# EAGLE design ATMEGA2560 Board (EAGLE 9.6.2)
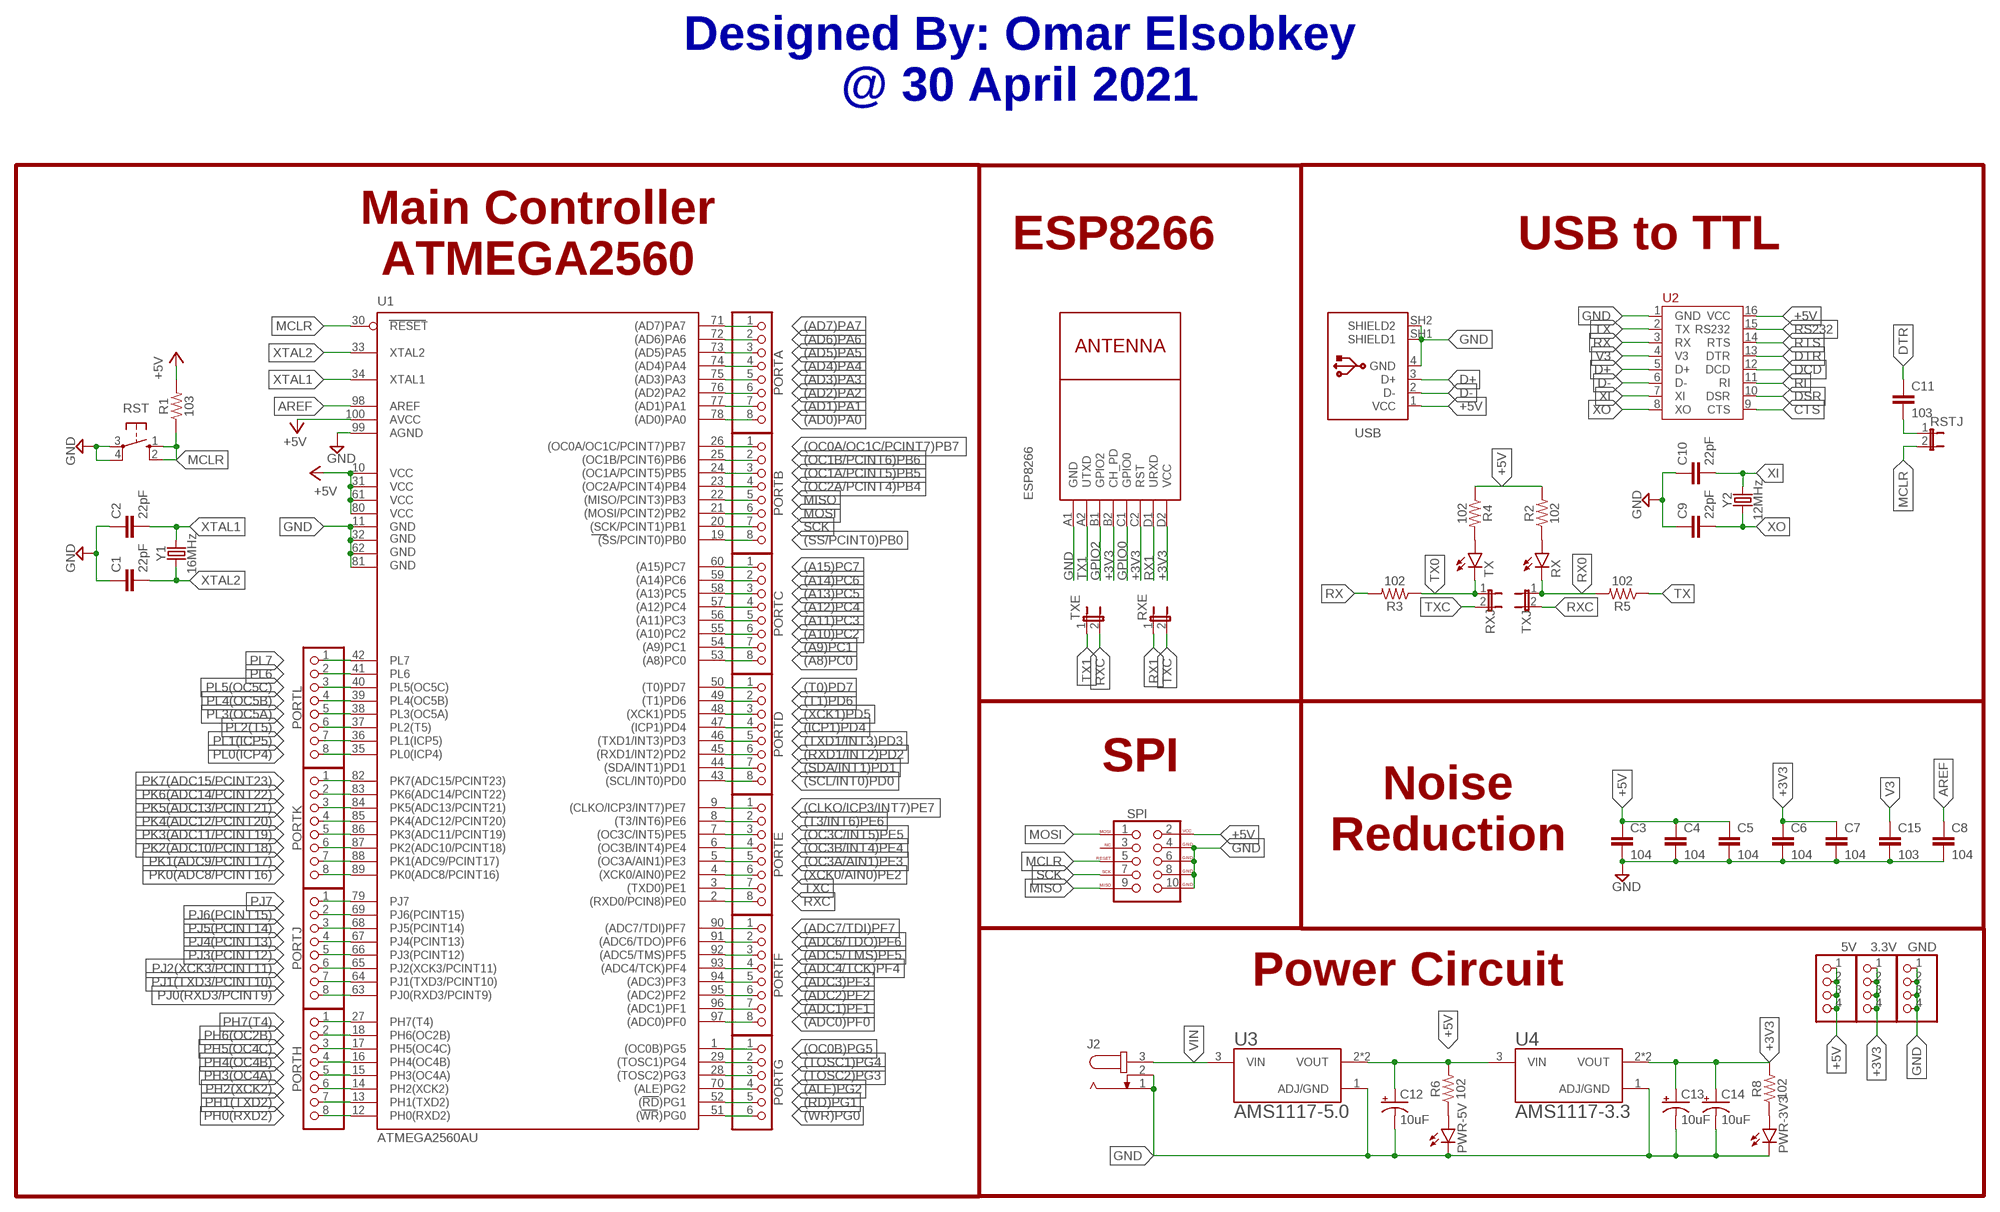
[diagram p0: schematic, sheet 1]

## Parts
3.3V  PINHD-1X4  [1X04]
5V  PINHD-1X4  [1X04]
C1  22pF  22PF-PTH-2.54MM-200V-5%  [CAP-PTH-2.54]
C2  22pF  22PF-PTH-2.54MM-200V-5%  [CAP-PTH-2.54]
C3  104  22PF-PTH-2.54MM-200V-5%  [CAP-PTH-2.54]
C4  104  22PF-PTH-2.54MM-200V-5%  [CAP-PTH-2.54]
C5  104  22PF-PTH-2.54MM-200V-5%  [CAP-PTH-2.54]
C6  104  22PF-PTH-2.54MM-200V-5%  [CAP-PTH-2.54]
C7  104  22PF-PTH-2.54MM-200V-5%  [CAP-PTH-2.54]
C8  104  22PF-PTH-2.54MM-200V-5%  [CAP-PTH-2.54]
C9  22pF  22PF-PTH-2.54MM-200V-5%  [CAP-PTH-2.54]
C10  22pF  22PF-PTH-2.54MM-200V-5%  [CAP-PTH-2.54]
C11  103  22PF-PTH-2.54MM-200V-5%  [CAP-PTH-2.54]
C12  10uF  10UF-POLAR-RADIAL-2.5MM-KIT-25V-20%  [CPOL-RADIAL-2.5MM-5MM-KIT]
C13  10uF  10UF-POLAR-RADIAL-2.5MM-KIT-25V-20%  [CPOL-RADIAL-2.5MM-5MM-KIT]
C14  10uF  10UF-POLAR-RADIAL-2.5MM-KIT-25V-20%  [CPOL-RADIAL-2.5MM-5MM-KIT]
C15  103  22PF-PTH-2.54MM-200V-5%  [CAP-PTH-2.54]
ESP8266  WIRELESS-WIFI-ESP-01  [WIRELESS-WIFI-ESP-01]
GND  PINHD-1X4  [1X04]
J2  JACK-PLUG0  [SPC4077]
PORTA  PINHD-1X8  [1X08]
PORTB  PINHD-1X8  [1X08]
PORTC  PINHD-1X8  [1X08]
PORTD  PINHD-1X8  [1X08]
PORTE  PINHD-1X8  [1X08]
PORTF  PINHD-1X8  [1X08]
PORTG  PINHD-1X6  [1X06]
PORTH  PINHD-1X8  [1X08]
PORTJ  PINHD-1X8  [1X08]
PORTK  PINHD-1X8  [1X08]
PORTL  PINHD-1X8  [1X08]
PWR-3V3  LEDCHIP-LED0805  [CHIP-LED0805]
PWR-5V  LEDCHIP-LED0805  [CHIP-LED0805]
R1  103  RESISTOR1206  [1206]
R2  102  RESISTOR1206  [1206]
R3  102  RESISTOR1206  [1206]
R4  102  RESISTOR1206  [1206]
R5  102  RESISTOR1206  [1206]
R6  102  RESISTOR1206  [1206]
R8  102  RESISTOR1206  [1206]
RST  10-XX  [B3F-10XX]
RSTJ  JP1E  [JP1]
RX  LEDCHIP-LED0805  [CHIP-LED0805]
RXE  JP1E  [JP1]
RXJ  JP1E  [JP1]
SPI  AVR_SPI_PROG_5X2LOCK  [2X5-SHROUDED_LOCK]
TX  LEDCHIP-LED0805  [CHIP-LED0805]
TXE  JP1E  [JP1]
TXJ  JP1E  [JP1]
U1  ATMEGA2560AU  [TQFP100]
U2  CH340G  [SOP-16]
U3  AMS1117-5.0  [AMS1117-5.0]
U4  AMS1117-3.3  AMS1117-5.0  [AMS1117-5.0]
USB  61729-1011  [61729-1011BLF]
Y1  16MHz  CRYSTALPTH-HC49UV  [HC49U]
Y2  12MHz  CRYSTALPTH-HC49UV  [HC49U]

## Nets
(A8)PC0: PORTC.8 U1.53((A8)PC0)
(A9)PC1: PORTC.7 U1.54((A9)PC1)
(A10)PC2: PORTC.6 U1.55((A10)PC2)
(A11)PC3: PORTC.5 U1.56((A11)PC3)
(A12)PC4: PORTC.4 U1.57((A12)PC4)
(A13)PC5: PORTC.3 U1.58((A13)PC5)
(A14)PC6: PORTC.2 U1.59((A14)PC6)
(A15)PC7: PORTC.1 U1.60((A15)PC7)
(AD0)PA0: PORTA.8 U1.78((AD0)PA0)
(AD1)PA1: PORTA.7 U1.77((AD1)PA1)
(AD2)PA2: PORTA.6 U1.76((AD2)PA2)
(AD3)PA3: PORTA.5 U1.75((AD3)PA3)
(AD4)PA4: PORTA.4 U1.74((AD4)PA4)
(AD5)PA5: PORTA.3 U1.73((AD5)PA5)
(AD6)PA6: PORTA.2 U1.72((AD6)PA6)
(AD7)PA7: PORTA.1 U1.71((AD7)PA7)
(ADC0)PF0: PORTF.8 U1.97((ADC0)PF0)
(ADC1)PF1: PORTF.7 U1.96((ADC1)PF1)
(ADC2)PF2: PORTF.6 U1.95((ADC2)PF2)
(ADC3)PF3: PORTF.5 U1.94((ADC3)PF3)
(ADC4/TCK)PF4: PORTF.4 U1.93((ADC4/TCK)PF4)
(ADC5/TMS)PF5: PORTF.3 U1.92((ADC5/TMS)PF5)
(ADC6/TDO)PF6: PORTF.2 U1.91((ADC6/TDO)PF6)
(ADC7/TDI)PF7: PORTF.1 U1.90((ADC7/TDI)PF7)
(ALE)PG2: PORTG.4 U1.70((ALE)PG2)
(CLKO/ICP3/INT7)PE7: PORTE.1 U1.9((CLKO/ICP3/INT7)PE7)
(ICP1)PD4: PORTD.4 U1.47((ICP1)PD4)
(OC0A/OC1C/PCINT7)PB7: PORTB.1 U1.26((OC0A/OC1C/PCINT7)PB7)
(OC0B)PG5: PORTG.1 U1.1((OC0B)PG5)
(OC1A/PCINT5)PB5: PORTB.3 U1.24((OC1A/PCINT5)PB5)
(OC1B/PCINT6)PB6: PORTB.2 U1.25((OC1B/PCINT6)PB6)
(OC2A/PCINT4)PB4: PORTB.4 U1.23((OC2A/PCINT4)PB4)
(OC3A/AIN1)PE3: PORTE.5 U1.5((OC3A/AIN1)PE3)
(OC3B/INT4)PE4: PORTE.4 U1.6((OC3B/INT4)PE4)
(OC3C/INT5)PE5: PORTE.3 U1.7((OC3C/INT5)PE5)
(RD)PG1: PORTG.5 U1.52((RD)PG1)
(RXD1/INT2)PD2: PORTD.6 U1.45((RXD1/INT2)PD2)
(SCL/INT0)PD0: PORTD.8 U1.43((SCL/INT0)PD0)
(SDA/INT1)PD1: PORTD.7 U1.44((SDA/INT1)PD1)
(SS/PCINT0)PB0: PORTB.8 U1.19((SS/PCINT0)PB0)
(T0)PD7: PORTD.1 U1.50((T0)PD7)
(T1)PD6: PORTD.2 U1.49((T1)PD6)
(T3/INT6)PE6: PORTE.2 U1.8((T3/INT6)PE6)
(TOSC1)PG4: PORTG.2 U1.29((TOSC1)PG4)
(TOSC2)PG3: PORTG.3 U1.28((TOSC2)PG3)
(TXD1/INT3)PD3: PORTD.5 U1.46((TXD1/INT3)PD3)
(WR)PG0: PORTG.6 U1.51((WR)PG0)
(XCK0/AIN0)PE2: PORTE.6 U1.4((XCK0/AIN0)PE2)
(XCK1)PD5: PORTD.3 U1.48((XCK1)PD5)
+3V3: 3.3V.1 3.3V.2 3.3V.3 3.3V.4 C6.1 C7.1 C13.1(+) C14.1(+) ESP8266.B2(CH_PD) ESP8266.C2(RST) ESP8266.D2(VCC) R8.2 U4.2(VOUT) U4.4(VOUT)
+5V: 5V.1 5V.2 5V.3 5V.4 C3.1 C4.1 C5.1 C12.1(+) R1.2 R2.2 R4.1 R6.2 SPI.2(VCC) U1.10(VCC) U1.31(VCC1) U1.61(VCC2) U1.80(VCC3) U1.100(AVCC) U2.16(VCC) U3.2(VOUT) U3.4(VOUT) U4.3(VIN) USB.1(VCC)
AREF: C8.1 U1.98(AREF)
CTS: U2.9(CTS)
D+: U2.5(D+) USB.3(D+)
D-: U2.6(D-) USB.2(D-)
DCD: U2.12(DCD)
DSR: U2.10(DSR)
DTR: C11.1 U2.13(DTR)
GND: C1.1 C2.1 C3.2 C4.2 C5.2 C6.2 C7.2 C8.2 C9.1 C10.1 C12.2(-) C13.2(-) C14.2(-) C15.2 ESP8266.A1(GND) GND.1 GND.2 GND.3 GND.4 J2.1 J2.2 PWR-3V3.C PWR-5V.C RST.3(P) RST.4(P1) SPI.4(GND) SPI.6(GND) SPI.8(GND) SPI.10(GND) U1.11(GND) U1.32(GND1) U1.62(GND2) U1.81(GND3) U1.99(AGND) U2.1(GND) U3.1(ADJ/GND) U4.1(ADJ/GND) USB.4(GND) USB.SH1(SHIELD1) USB.SH2(SHIELD2)
GPIO0: ESP8266.C1(GPIO0)
GPIO2: ESP8266.B1(GPIO2)
MCLR: R1.1 RST.1(S) RST.2(S1) RSTJ.2 SPI.5(RESET) U1.30(RESET)
MISO: PORTB.5 SPI.9(MISO) U1.22((MISO/PCINT3)PB3)
MOSI: PORTB.6 SPI.1(MOSI) U1.21((MOSI/PCINT2)PB2)
N$1: R2.1 RX.A
N$2: R4.2 TX.A
N$3: PWR-5V.A R6.1
N$6: PWR-3V3.A R8.1
N$100: C11.2 RSTJ.1
PH0(RXD2): PORTH.8 U1.12(PH0(RXD2))
PH1(TXD2): PORTH.7 U1.13(PH1(TXD2))
PH2(XCK2): PORTH.6 U1.14(PH2(XCK2))
PH3(OC4A): PORTH.5 U1.15(PH3(OC4A))
PH4(OC4B): PORTH.4 U1.16(PH4(OC4B))
PH5(OC4C): PORTH.3 U1.17(PH5(OC4C))
PH6(OC2B): PORTH.2 U1.18(PH6(OC2B))
PH7(T4): PORTH.1 U1.27(PH7(T4))
PJ0(RXD3/PCINT9): PORTJ.8 U1.63(PJ0(RXD3/PCINT9))
PJ1(TXD3/PCINT10): PORTJ.7 U1.64(PJ1(TXD3/PCINT10))
PJ2(XCK3/PCINT11): PORTJ.6 U1.65(PJ2(XCK3/PCINT11))
PJ3(PCINT12): PORTJ.5 U1.66(PJ3(PCINT12))
PJ4(PCINT13): PORTJ.4 U1.67(PJ4(PCINT13))
PJ5(PCINT14): PORTJ.3 U1.68(PJ5(PCINT14))
PJ6(PCINT15): PORTJ.2 U1.69(PJ6(PCINT15))
PJ7: PORTJ.1 U1.79(PJ7)
PK0(ADC8/PCINT16): PORTK.8 U1.89(PK0(ADC8/PCINT16))
PK1(ADC9/PCINT17): PORTK.7 U1.88(PK1(ADC9/PCINT17))
PK2(ADC10/PCINT18): PORTK.6 U1.87(PK2(ADC10/PCINT18))
PK3(ADC11/PCINT19): PORTK.5 U1.86(PK3(ADC11/PCINT19))
PK4(ADC12/PCINT20): PORTK.4 U1.85(PK4(ADC12/PCINT20))
PK5(ADC13/PCINT21): PORTK.3 U1.84(PK5(ADC13/PCINT21))
PK6(ADC14/PCINT22): PORTK.2 U1.83(PK6(ADC14/PCINT22))
PK7(ADC15/PCINT23): PORTK.1 U1.82(PK7(ADC15/PCINT23))
PL0(ICP4): PORTL.8 U1.35(PL0(ICP4))
PL1(ICP5): PORTL.7 U1.36(PL1(ICP5))
PL2(T5): PORTL.6 U1.37(PL2(T5))
PL3(OC5A): PORTL.5 U1.38(PL3(OC5A))
PL4(OC5B): PORTL.4 U1.39(PL4(OC5B))
PL5(OC5C): PORTL.3 U1.40(PL5(OC5C))
PL6: PORTL.2 U1.41(PL6)
PL7: PORTL.1 U1.42(PL7)
RI: U2.11(RI)
RS232: U2.15(RS232)
RTS: U2.14(RTS)
RX: R3.2 U2.3(RX)
RX0: R5.2 RX.C TXJ.1
RX1: ESP8266.D1(URXD) RXE.1
RXC: PORTE.8 TXE.2 TXJ.2 U1.2((RXD0/PCIN8)PE0)
SCK: PORTB.7 SPI.7(SCK) U1.20((SCK/PCINT1)PB1)
TX: R5.1 U2.2(TX)
TX0: R3.1 RXJ.1 TX.C
TX1: ESP8266.A2(UTXD) TXE.1
TXC: PORTE.7 RXE.2 RXJ.2 U1.3((TXD0)PE1)
V3: C15.1 U2.4(V3)
VIN: J2.3 U3.3(VIN)
XI: C10.2 U2.7(XI) Y2.2
XO: C9.2 U2.8(XO) Y2.1
XTAL1: C2.2 U1.34(XTAL1) Y1.2
XTAL2: C1.2 U1.33(XTAL2) Y1.1
Unconnected: SPI.3(NC)

## Notes on the sheet
- Designed By: Omar Elsobkey
  @ 30 April 2021
- Main Controller
  ATMEGA2560
- ESP8266 | USB to TTL
- SPI
- Noise
  Reduction
- Power Circuit

## Library data of the parts
3.3V 5V GND = pinhead:PINHD-1X4: PIN HEADER
C1 C2 C9 C10 = SparkFun-Capacitors:22PF: 22pF ceramic capacitors A capacitor is a passive two-terminal electrical component used to store electrical energy temporarily in an electric field.; PROD_ID: CAP-09128
C3-C8 C11 C15 = SparkFun-Capacitors:22PF: 22pF ceramic capacitors A capacitor is a passive two-terminal electrical component used to store electrical energy temporarily in an electric field.; PROD_ID: CAP-09128; VALUE: 22pF
C12-C14 = SparkFun-Capacitors:10UF-POLAR: 10.0µF polarized capacitors A capacitor is a passive two-terminal electrical component used to store electrical energy temporarily in an electric field.; PROD_ID: CAP-08440
ESP8266 = Modules:WIRELESS-WIFI-ESP-01: Wireless Wi-Fi ESP-01 Module based on ESP8266 chip Click here to find device on ebay.com <http://www.ebay.com/sch/esp8266+esp+01+transceiver>
J2 = con-jack:JACK-PLUG: DC POWER JACK Power Jack, DC, Right Angle, Through Hole, Rated 5A at 16VDC, PC Terminals Distributor: Farnell (www.Farnell.de) Drawing: 84N1161.pdf / 84N1162.pdf Manufacturer: SPC Technology (www.spctechnology.com) Type: SPC4077 / SPC 4078; OC_FARNELL: unknown; OC_NEWARK: unknown
PORTA PORTB PORTC PORTD PORTE PORTF PORTH PORTJ PORTK PORTL = pinhead:PINHD-1X8: PIN HEADER
PORTG = pinhead:PINHD-1X6: PIN HEADER
PWR-3V3 PWR-5V RX TX = led:LED: LED OSRAM: - CHIPLED LG R971, LG N971, LY N971, LG Q971, LY Q971, LO R971, LY R971 LH N974, LH R974 LS Q976, LO Q976, LY Q976 LO Q996 - Hyper CHIPLED LW Q18S LB Q993, LB Q99A, LB R99A - SideLED LS A670, LO A670, LY A670, LG A670, LP A670 LB A673, LV A673, LT A673, LW A673 LH A674 LY A675 LS A676, LA A676, LO A676, LY A676, LW A676 LS A679, LY A679, LG A679 - Hyper Micro SIDELED® LS Y876, LA Y876, LO Y876, LY Y876 LT Y87S - SmartLED LW L88C, LW L88S LB L89C, LB L89S, LG L890 LS L89K, LO L89K, LY L89K LS L896, LA L896, LO L896, LY L896 - TOPLED LS T670, LO T670, LY T670, LG T670, LP T670 LSG T670, LSP T670, LSY T670, LOP T670, LYG T670 LG T671, LOG T671, LSG T671 LB T673, LV T673, LT T673, LW T673 LH T674 LS T676, LA T676, LO T676, LY T676, LB T676, LH T676, LSB T676, LW T676 LB T67C, LV T67C, LT T67C, LS T67K, LO T67K, LY T67K, LW E67C LS E67B, LA E67B, LO E67B, LY E67B, LB E67C, LV E67C, LT E67C LW T67C LS T679, LY T679, LG T679 LS T770, LO T770, LY T770, LG T770, LP T770 LB T773, LV T773, LT T773, LW T773 LH T774 LS E675, LA E675, LY E675, LS T675 LS T776, LA T776, LO T776, LY T776, LB T776 LHGB T686 LT T68C, LB T68C - Hyper Mini TOPLED® LB M676 - Mini TOPLED Santana® LG M470 LS M47K, LO M47K, LY M47K Source: http://www.osram.convergy.de LUXEON: - LUMILED® LXK2-PW12-R00, LXK2-PW12-S00, LXK2-PW14-U00, LXK2-PW14-V00 LXK2-PM12-R00, LXK2-PM12-S00, LXK2-PM14-U00 LXK2-PE12-Q00, LXK2-PE12-R00, LXK2-PE12-S00, LXK2-PE14-T00, LXK2-PE14-U00 LXK2-PB12-K00, LXK2-PB12-L00, LXK2-PB12-M00, LXK2-PB14-N00, LXK2-PB14-P00, LXK2-PB14-Q00 LXK2-PR12-L00, LXK2-PR12-M00, LXK2-PR14-Q00, LXK2-PR14-R00 LXK2-PD12-Q00, LXK2-PD12-R00, LXK2-PD12-S00 LXK2-PH12-R00, LXK2-PH12-S00 LXK2-PL12-P00, LXK2-PL12-Q00, LXK2-PL12-R00 Source: www.luxeon.com KINGBRIGHT: KA-3528ASYC Source: www.kingbright.com
R1-R6 R8 = SparkFun-Resistors:RESISTOR: Generic Resistor Package
RST = switch-omron:10-XX: OMRON SWITCH; MPN: B3F-1000; OC_FARNELL: 176432; OC_NEWARK: 36M3542
RSTJ RXE RXJ TXE TXJ = jumper:JP1E: JUMPER
SPI = SparkFun-Connectors:AVR_SPI_PROG_5X2: AVR 10-pin ICSP Header This is the standard AVR In Circuit Serial Programming header. Minimal, but includes pin one indicator. Works with standard Olimex programmers. SparkFun Products: 2x5 AVR ICSP Male Header <https://www.sparkfun.com/products/778> - PTH 2x5 Pin Shrouded Header <https://www.sparkfun.com/products/8506> - PTH2; PROD_ID: CONN-08671; SF_ID: PRT-08506
U1 = SparkFun-IC-Microcontroller:ATMEGA2560: Atmel 100-pin 8-bit uC 64/128/256 Kbytes FLASH 4 Kbytes EEPROM 8 Kbytes SRAM 86 General Purpose I/O pins 12-channels16-bit PWM 4 x Serial USARTs 16-channels 10-bit A/D SparkFun Products None.; PROD_ID: IC-10040
U2 = CH340G:CH340G
U3 U4 = AMS1117-5.0:AMS1117-5.0: Sot223/Pkg 1-Amp 5-Volt Low Drop Out Voltage Regulatator; AVAILABILITY: Unavailable; DESCRIPTION: Sot223/Pkg 1-Amp 5-Volt Low Drop Out Voltage Regulatator; MF: Advanced Monolithic Systems; MP: AMS1117-5.0; PACKAGE: None; PRICE: None
USB = Connector_USB:61729-1011: USB(2.0) Type-B, RCPT, 4POS, THT-R/A Datasheet <https://www.amphenol-icc.com/media/wysiwyg/files/drawing/61729.pdf>; CATEGORY: Connector; CONTACTS: 4; CURRENT_RATING: 1A; DESCRIPTION: CONN RCPT USB2.0 TYPEB 4POS R/A; GENDER: Receptacle; MANUFACTURER: Amphenol ICC (FCI); MOUNT_TYPE: R/A; MPN: 61729-1011BLF; OPERATING_TEMP: -55°C to 85°C; PART_STATUS: Active; ROHS_COMPLIANT: RoHS Compliant; SERIES: 61729; SUB-CATEGORY: USB; TYPE: USB-B
Y1 Y2 = SparkFun-Clocks:CRYSTAL: Crystals (Generic) These are passive quartz crystals, which can be used as a clock source for a microcontroller. Crystal's are two-terminal devices. They require external "load" capacitors to generate an oscillating signal.

## Board
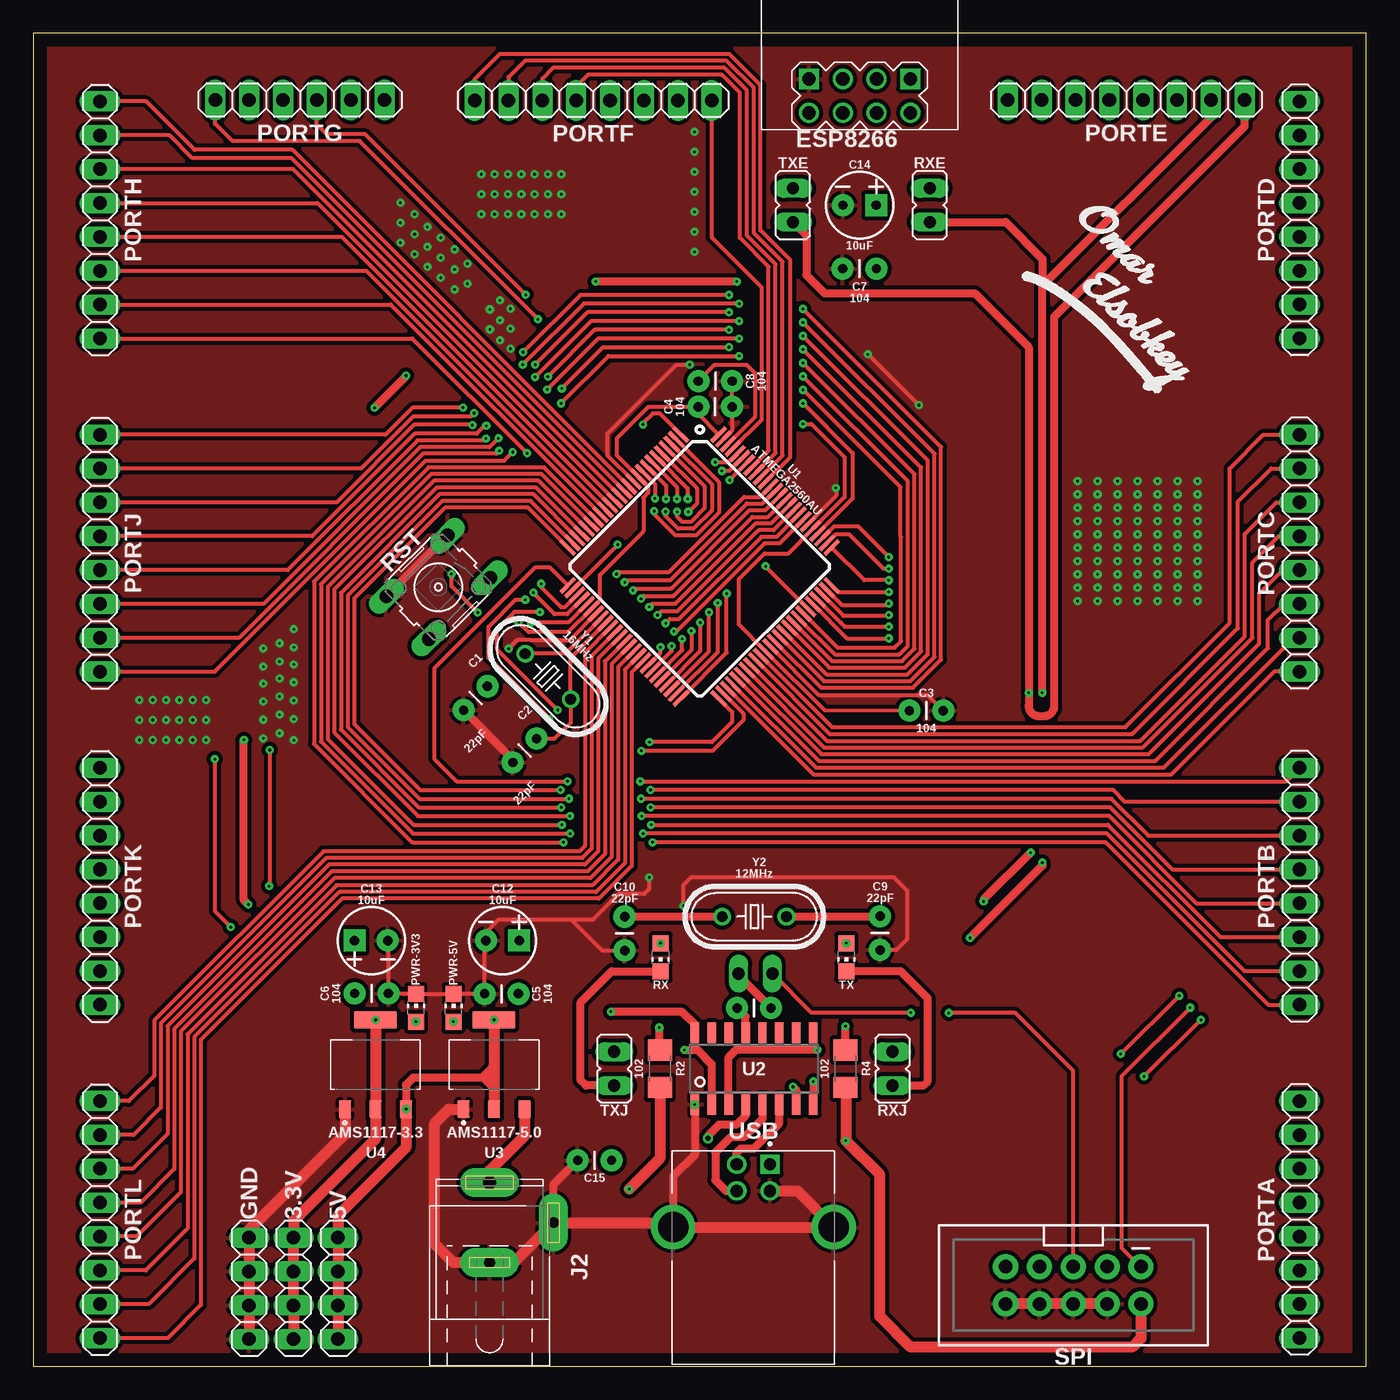
[diagram p1: board, top side]
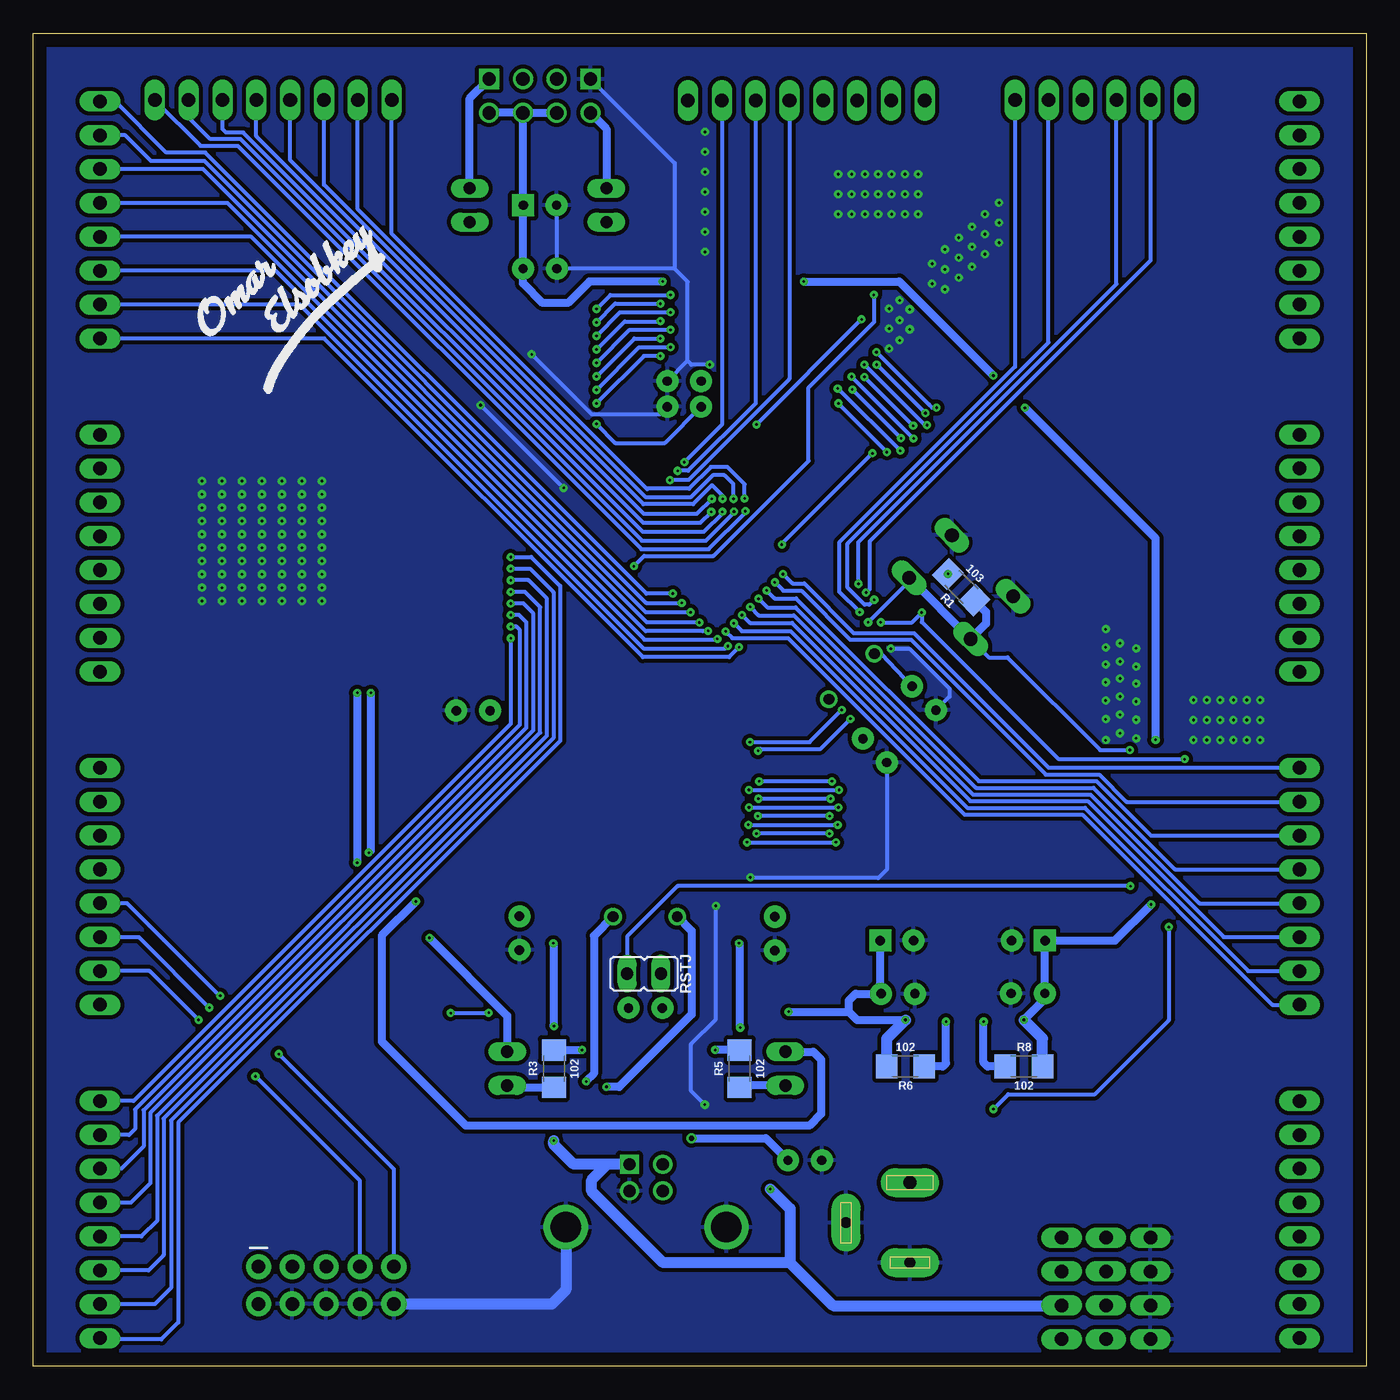
[diagram p2: board, bottom side, seen from below]

Size 100 x 100 mm. Coordinates in mm from the lower left corner, seen from the top.
Outline: 0,0 100,0 100,100 0,100 0,0
Copper layers (1*16): Top 0.035mm / dielectric 1.5mm / Bottom 0.035mm
Design rules "default *": minimum track width 0.3mm, minimum drill 0.2mm, track to track 0.2mm, track to pad 0.2mm, pad to pad 0.2mm, via to via 0.2mm, smd to smd 0.2mm, copper to edge 40mil, drill to drill 6mil, minimum pad ring 10mil, minimum via ring 8mil, stop-mask expansion 4mil, vias tented up to drill 0mil, thermal gap 10mil

### Footprints (pad centres in the part's own frame; a part is rotated, then mirrored left to right if it is on the bottom)
1X04 = drill 1.016 long: 1 -3.81,0; 2 -1.27,0; 3 1.27,0; 4 3.81,0
CAP-PTH-2.54 = drill 0.7 pad 1.651: 1 -1.27,0; 2 1.27,0
CPOL-RADIAL-2.5MM-5MM-KIT = drill 0.7 pad 1.651 square: 1 1.25,0 | drill 0.7 pad 1.651: 2 -1.25,0
WIRELESS-WIFI-ESP-01 = drill 1 square: A1 -8.89,3.81; D1 -8.89,-3.81 | drill 1: A2 -11.43,3.81; B1 -8.89,1.27; B2 -11.43,1.27; C1 -8.89,-1.27; C2 -11.43,-1.27; D2 -11.43,-3.81
SPC4077 = drill 0.8 pad 2.184 long: 1 -3,0; 2 0,-4.8 | drill 1 pad 2.184 long: 3 3,0
1X08 = drill 1.016 long: 1 -8.89,0; 2 -6.35,0; 3 -3.81,0; 4 -1.27,0; 5 1.27,0; 6 3.81,0; 7 6.35,0; 8 8.89,0
1X06 = drill 1.016 long: 1 -6.35,0; 2 -3.81,0; 3 -1.27,0; 4 1.27,0; 5 3.81,0; 6 6.35,0
CHIP-LED0805 = smd 1.2 x 1.2: A 0,-1.05; C 0,1.05
1206 = smd 1.6 x 1.8: 1 -1.4,0; 2 1.4,0
B3F-10XX = drill 1.016 long: 1 -3.251,2.261; 2 3.251,2.261; 3 -3.251,-2.261; 4 3.251,-2.261
JP1 = drill 0.914 long: 1 0,-1.27; 2 0,1.27
2X5-SHROUDED_LOCK = drill 1.016 pad 1.88: 1 -1.397,5.08; 2 1.397,5.08; 3 -1.397,2.54; 4 1.397,2.54; 5 -1.397,0; 6 1.397,0; 7 -1.397,-2.54; 8 1.397,-2.54; 9 -1.397,-5.08; 10 1.397,-5.08
TQFP100 = smd 1.5 x 0.3: 1 -8,6; 2 -8,5.5; 3 -8,5; 4 -8,4.5; 5 -8,4; 6 -8,3.5; 7 -8,3; 8 -8,2.5; 9 -8,2; 10 -8,1.5; 11 -8,1; 12 -8,0.5; 13 -8,0; 14 -8,-0.5; 15 -8,-1; 16 -8,-1.5; 17 -8,-2; 18 -8,-2.5; 19 -8,-3; 20 -8,-3.5; 21 -8,-4; 22 -8,-4.5; 23 -8,-5; 24 -8,-5.5; 25 -8,-6; 51 8,-6; 52 8,-5.5; 53 8,-5; 54 8,-4.5; 55 8,-4; 56 8,-3.5; 57 8,-3; 58 8,-2.5; 59 8,-2; 60 8,-1.5; 61 8,-1; 62 8,-0.5; 63 8,0; 64 8,0.5; 65 8,1; 66 8,1.5; 67 8,2; 68 8,2.5; 69 8,3; 70 8,3.5; 71 8,4; 72 8,4.5; 73 8,5; 74 8,5.5; 75 8,6 | smd 0.3 x 1.5: 26 -6,-8; 27 -5.5,-8; 28 -5,-8; 29 -4.5,-8; 30 -4,-8; 31 -3.5,-8; 32 -3,-8; 33 -2.5,-8; 34 -2,-8; 35 -1.5,-8; 36 -1,-8; 37 -0.5,-8; 38 0,-8; 39 0.5,-8; 40 1,-8; 41 1.5,-8; 42 2,-8; 43 2.5,-8; 44 3,-8; 45 3.5,-8; 46 4,-8; 47 4.5,-8; 48 5,-8; 49 5.5,-8; 50 6,-8; 76 6,8; 77 5.5,8; 78 5,8; 79 4.5,8; 80 4,8; 81 3.5,8; 82 3,8; 83 2.5,8; 84 2,8; 85 1.5,8; 86 1,8; 87 0.5,8; 88 0,8; 89 -0.5,8; 90 -1,8; 91 -1.5,8; 92 -2,8; 93 -2.5,8; 94 -3,8; 95 -3.5,8; 96 -4,8; 97 -4.5,8; 98 -5,8; 99 -5.5,8; 100 -6,8
SOP-16 = smd 0.635 x 1.524: 1 -4.445,-2.695; 2 -3.175,-2.695; 3 -1.905,-2.695; 4 -0.635,-2.695; 5 0.635,-2.695; 6 1.905,-2.695; 7 3.175,-2.695; 8 4.445,-2.695; 9 4.445,2.695; 10 3.175,2.695; 11 1.905,2.695; 12 0.635,2.695; 13 -0.635,2.695; 14 -1.905,2.695; 15 -3.175,2.695; 16 -4.445,2.695
AMS1117-5.0 = smd 0.93 x 1.31: 1 -2.29,-3.345; 2 0,-3.345; 3 2.29,-3.345 | smd 3.24 x 1.31: 4 0,3.345
61729-1011BLF = drill 0.92 square: 1 1.25,4.71 | drill 0.92: 2 -1.25,4.71; 3 -1.25,2.71; 4 1.25,2.71 | drill 2.3: SH1 -6.02,0; SH2 6.02,0
HC49U = drill 0.813: 1 -2.413,0; 2 2.413,0

### Placement (x,y rotation side)
3.3V  19.52,5.83 270 top
5V  22.86,5.83 270 top
C1  33.18,50.11 45 top
C2  36.86,46.19 45 top
C3  67,49.18 0 top
C4  51.16,71.99 0 top
C5  35.13,27.94 180 top
C6  25.37,27.97 0 top
C7  61.99,82.35 180 top
C8  51.16,73.91 0 top
C9  63.53,32.49 90 top
C10  44.36,32.46 90 top
C11  54.07,26.87 0 top
C12  35.2,31.93 0 top
C13  25.35,31.93 180 top
C14  61.99,87.1 0 top
C15  42.11,15.44 180 top
ESP8266  62,105.46 90 top
GND  16.19,5.83 270 top
J2  34.23,10.76 90 top
PORTA  95,11 270 top
PORTB  95,36 270 top
PORTC  95,61 270 top
PORTD  95,86 270 top
PORTE  82,95 0 top
PORTF  42,94.97 0 top
PORTG  20,95 0 top
PORTH  5,86 90 top
PORTJ  5,61 90 top
PORTK  5,36 90 top
PORTL  5,11 90 top
PWR-3V3  28.7,26.9 0 top
PWR-5V  31.52,26.9 0 top
R1  30.38,58.45 135 bottom
R2  47.01,22.32 270 top
R3  60.94,22.32 90 bottom
R4  60.94,22.32 90 top
R5  47.01,22.32 270 bottom
R6  34.57,22.48 180 bottom
R8  25.68,22.48 0 bottom
RST  30.38,58.45 225 top
RSTJ  54.18,29.45 90 bottom
RX  47.06,30.68 180 top
RXE  67.26,87.1 180 top
RXJ  64.45,22.32 0 top
SPI  78.03,6.07 270 top
TX  60.99,30.68 180 top
TXE  57,87.1 180 top
TXJ  43.58,22.32 0 top
U1  50,60 315 top
U2  54.07,22.32 0 top
U3  34.57,22.63 0 top
U4  25.68,22.63 0 top
U$1  [OMAR_ELSOBKEY_X1]  81.53,80.47 315 top
U$2  [OMAR_ELSOBKEY_X1]  81.08,80.37 45 bottom
USB  54.02,10.44 0 top
Y1  38.61,51.75 315 top
Y2  54.1,33.73 180 top

### Tracks (layer width: path | path; a pad name or v marks a point on that pad's centre or on a via)
(A8)PC0
  Top 0.3: U1.53 58.53,44.4 85.39,44.4 93.11,52.11 PORTC.8
(A9)PC1
  Top 0.3: U1.54 58.73,44.91 84.81,44.91 94.55,54.65 PORTC.7
(A10)PC2
  Top 0.3: U1.55 58.93,45.41 84.18,45.41 92.63,53.87 92.63,55.98 93.84,57.19 PORTC.6
(A11)PC3
  Top 0.3: U1.56 59.13,45.92 83.69,45.92 91.97,54.2 91.97,57.97 93.73,59.73 PORTC.5
(A12)PC4
  Top 0.3: U1.57 | PORTC.4 93.44,62.27 91.47,60.31 91.47,54.63 83.26,46.42 59.33,46.42 U1.57
(A13)PC5
  Top 0.3: U1.58 59.54,46.92 83.05,46.92 90.88,54.75 90.88,62.43 93.26,64.81 PORTC.3
(A14)PC6
  Top 0.3: U1.59 59.72,47.45 82.45,47.45 90.38,55.38 90.38,64.85 92.88,67.35 PORTC.2
(A15)PC7
  Top 0.3: U1.60 59.93,47.95 81.94,47.95 89.76,55.77 89.76,67.36 92.29,69.89 PORTC.1
(AD0)PA0  (via drill 0.2 pad 0.3)
  Top 0.3: U1.78 60.09,63.02 61.87,63.02 v64.19,60.71
  Bottom 0.3: 64.19,60.69 v64.19,60.71 64.17,60.72 62.66,60.72 60.48,58.54 60.48,46.92 89.12,18.28 89.12,3.29 90.4,2.01 94.9,2.01 PORTA.8
(AD1)PA1  (via drill 0.2 pad 0.3)
  Top 0.3: U1.77 60.2,62.43 61.2,62.43 63.79,59.84 v64.19,59.84
  Bottom 0.3: 64.19,59.82 v64.19,59.84 62.73,59.84 60.98,58.08 60.98,47.13 89.66,18.44 89.66,5.87 90.88,4.65 PORTA.7
(AD2)PA2  (via drill 0.2 pad 0.3)
  Top 0.3: U1.76 62.34,58.98 64.17,58.98 v64.19,58.96 64.19,58.99
  Bottom 0.3: PORTA.6 91.36,7.19 90.22,8.33 90.22,18.59 61.48,47.33 61.48,57.58 62.86,58.96 v64.19,58.96
(AD3)PA3  (via drill 0.2 pad 0.3)
  Top 0.3: U1.75 60.4,58.09 v64.18,58.09 v64.19,58.09
  Bottom 0.3: PORTA.5 91.9,9.73 90.72,10.91 90.72,18.8 61.98,47.54 61.98,56.95 63.12,58.09 v64.19,58.09
(AD4)PA4  (via drill 0.2 pad 0.3)
  Top 0.3: U1.74 | U1.74 60.66,57.11 64.08,57.11 v64.19,57.22
  Bottom 0.3: PORTA.4 92.68,12.27 91.22,13.73 91.22,19 62.48,47.75 62.48,56.46 63.23,57.22 v64.19,57.22
(AD5)PA5  (via drill 0.2 pad 0.3)
  Top 0.3: U1.73 60.76,56.31 64.14,56.31 v64.19,56.35
  Bottom 0.3: v64.19,56.35 64.17,56.37 63.56,56.37 63,55.8 63,47.93 91.72,19.21 91.72,16.48 93.39,14.81 PORTA.3
(AD6)PA6  (via drill 0.2 pad 0.3)
  Top 0.3: U1.72 60.61,55.76 60.88,55.48 v64.19,55.48
  Bottom 0.3: PORTA.2 92.81,17.35 92.37,17.79 92.37,19.27 63.5,48.14 63.5,55.22 63.76,55.48 v64.19,55.48
(AD7)PA7  (via drill 0.2 pad 0.3)
  Top 0.3: v64.19,54.61 61.05,54.61 U1.71
  Bottom 0.3: PORTA.1 92.48,19.89 64.19,48.18 v64.19,54.61
(ADC0)PF0
  Top 0.3: 53.11,69.47 U1.97 54.63,71 54.63,80.95 50.89,84.69 PORTF.8
(ADC1)PF1  (via drill 0.2 pad 0.3)
  Top 0.3: v51.16,67.83 52.17,67.83 U1.96
  Bottom 0.3: PORTF.7 48.35,70.64 v51.16,67.83
(ADC2)PF2  (via drill 0.2 pad 0.3)
  Top 0.3: v51.66,67.18 52.23,67.18 U1.95
  Bottom 0.3: PORTF.6 45.81,72.24 50.87,67.18 v51.66,67.18
(ADC3)PF3  (via drill 0.2 pad 0.3)
  Top 0.3: v52.24,66.48 | v52.24,66.48 U1.94
  Bottom 0.3: PORTF.5 43.27,74.06 50.84,66.48 v52.24,66.48
(ADC4/TCK)PF4
  Top 0.3: U1.93 55.16,68.69 55.16,82.49 53,84.65 53,95.55 51.66,96.89 41.63,96.89 40.73,95.99 PORTF.4
(ADC5/TMS)PF5
  Top 0.3: U1.92 55.69,68.51 55.69,82.67 53.53,84.83 53.53,95.73 51.81,97.44 39.04,97.44 38.19,96.6 PORTF.3
(ADC6/TDO)PF6
  Top 0.3: U1.91 56.21,68.33 56.21,82.86 54.05,85.01 54.05,95.91 52.02,97.94 36.88,97.94 35.65,96.71 PORTF.2
(ADC7/TDI)PF7
  Top 0.3: U1.90 56.79,68.21 56.79,82.98 54.55,85.22 54.55,96.12 52.23,98.44 34.99,98.44 33.11,96.56 PORTF.1
(ALE)PG2  (via drill 0.2 pad 0.3)
  Top 0.3: U1.70 v54.94,60.01 v54.94,60.02 | v36.95,80.38 24.91,92.42 22.01,92.42 21.26,93.17 PORTG.4
  Bottom 0.3: v54.94,60.02 54.18,60.78 48.98,60.78 41.83,67.92 41.83,73.43 36.91,78.36 36.91,80.34 v36.95,80.38
(CLKO/ICP3/INT7)PE7  (via drill 0.2 pad 0.3)
  Top 0.3: U1.9 46.63,66.19 v46.63,65.1
  Bottom 0.3: PORTE.1 73.11,84.97 53.95,65.8 53.92,65.83 50.79,65.83 49.16,67.46 47.93,67.46 46.63,66.17 v46.63,65.1
(ICP1)PD4  (via drill 0.2 pad 0.3)
  Top 0.3: U1.47 50.03,53.67 v50.03,55.8
  Bottom 0.3: PORTD.4 85.43,87.27 53.96,55.8 v50.03,55.8
(OC0A/OC1C/PCINT7)PB7  (via drill 0.2 pad 0.3)
  Top 0.3: U1.26 38.78,59.91 37.63,59.91 30.07,52.35 30.07,45.57 31.76,43.88 v40.08,43.88 | v45.53,43.88 93.99,43.88 PORTB.1
  Bottom 0.3: v40.08,43.88 v45.53,43.88
(OC0B)PG5  (via drill 0.2 pad 0.3)
  Top 0.3: U1.1 47.01,71.48 46.48,71.48 45.75,70.74 v45.75,70.66 | v37.86,78.55 24.49,91.92 14.94,91.92 13.64,93.22 PORTG.1
  Bottom 0.3: v45.75,70.66 v37.86,78.55
(OC1A/PCINT5)PB5  (via drill 0.2 pad 0.3)
  Top 0.3: U1.24 37.31,64.91 30.68,64.91 23.58,57.82 23.58,47.96 28.97,42.57 v40.18,42.57 | PORTB.3 83.65,39.81 80.88,42.57 v45.59,42.57
  Bottom 0.3: v40.18,42.57 v45.59,42.57
(OC1B/PCINT6)PB6  (via drill 0.2 pad 0.3)
  Top 0.3: U1.25 37.1,64.41 30.89,64.41 24.08,57.61 24.08,48.17 29.03,43.23 v39.55,43.23 | PORTB.2 81.89,42.35 81.02,43.23 v46.3,43.23
  Bottom 0.3: v46.3,43.23 v39.55,43.23
(OC2A/PCINT4)PB4  (via drill 0.2 pad 0.3)
  Top 0.3: U1.23 37.52,65.41 30.47,65.41 23.08,58.02 23.08,47.76 28.92,41.92 v39.6,41.92 | v46.3,41.92 80.8,41.92 85.45,37.27 PORTB.4
  Bottom 0.3: v46.3,41.92 v39.6,41.92
(OC3A/AIN1)PE3  (via drill 0.2 pad 0.3)
  Top 0.3: U1.5 49.78,65.87 49.78,64.71 49.17,64.1 v49.13,64.1
  Bottom 0.3: PORTE.5 83.27,92.3 54.23,63.26 49.97,63.26 v49.13,64.1
(OC3B/INT4)PE4  (via drill 0.2 pad 0.3)
  Top 0.3: v49.1,65.08 49.1,65.85 U1.6
  Bottom 0.3: PORTE.4 80.73,90.46 54.2,63.93 50.24,63.93 v49.1,65.08
(OC3C/INT5)PE5  (via drill 0.2 pad 0.3)
  Top 0.3: U1.7 48.28,65.96 v48.28,65.08
  Bottom 0.3: PORTE.3 78.19,88.63 54.24,64.68 50.49,64.68 49.08,66.09 48.28,65.3 v48.28,65.08
(RD)PG1  (via drill 0.2 pad 0.3)
  Top 0.3: U1.52 | U1.52 53.26,48.96 53.26,48.47 50.96,46.16 v45.62,46.16 | v36.91,57.5 36.18,57.5 34.15,55.47 34.15,53.16 38.69,48.62 v38.69,48.56
  Bottom 0.3: v45.62,46.16 45.47,46.32 40.94,46.32 v38.69,48.56 | v36.91,57.5 37.28,57.13 37.64,57.13 38.91,58.4 38.91,61.71 23.82,76.8 23.82,94.98 PORTG.5
(RXD1/INT2)PD2  (via drill 0.2 pad 0.3)
  Top 0.3: U1.45 48.68,53.73 v48.68,54.57
  Bottom 0.3: PORTD.6 81.83,82.19 54.15,54.51 48.73,54.51 v48.68,54.57
(SCL/INT0)PD0  (via drill 0.2 pad 0.3)
  Top 0.3: U1.43 47.04,53.51 v47.04,53.95
  Bottom 0.3: v47.04,53.95 47.79,53.2 54.26,53.2 78.17,77.11 PORTD.8
(SDA/INT1)PD1  (via drill 0.2 pad 0.3)
  Top 0.3: U1.44 47.89,53.65 v47.89,54.04
  Bottom 0.3: PORTD.7 80,79.65 54.16,53.81 48.12,53.81 v47.89,54.04
(SS/PCINT0)PB0  (via drill 0.2 pad 0.3)
  Top 0.3: U1.19 38.32,67.44 29.64,67.44 21.06,58.85 21.06,46.69 28.43,39.31 v39.78,39.31 | PORTB.8 92.66,27.11 80.47,39.31 v46.46,39.31
  Bottom 0.3: v46.46,39.31 v39.78,39.31
(T0)PD7  (via drill 0.2 pad 0.3)
  Top 0.3: U1.50 52.02,53.54 v52.02,57.97
  Bottom 0.3: PORTD.1 93.85,94.89 90.02,91.06 87.1,91.06 54,57.97 v52.02,57.97
(T1)PD6  (via drill 0.2 pad 0.3)
  Top 0.3: U1.49 51.35,53.57 v51.35,57.27
  Bottom 0.3: v51.35,57.27 54.02,57.27 87.18,90.43 91.18,90.43 93.09,92.35 PORTD.2
(T3/INT6)PE6  (via drill 0.2 pad 0.3)
  Top 0.3: U1.8 47.47,66.06 v47.47,65.08
  Bottom 0.3: PORTE.2 75.65,86.8 54.03,65.18 50.7,65.18 49.02,66.85 48.16,66.85 47.47,66.17 v47.47,65.08
(TOSC1)PG4  (via drill 0.2 pad 0.3)
  Top 0.3: U1.29 40.05,56.41 39.09,56.41 37.52,57.99 v37.52,58.04
  Bottom 0.3: v37.52,58.04 37.26,58.29 37.26,61.87 16.19,82.95 PORTG.2
(TOSC2)PG3  (via drill 0.2 pad 0.3)
  Top 0.3: U1.28 39.85,56.92 39.62,56.92 38.1,58.45 v38.1,58.7
  Bottom 0.3: v38.1,58.7 38.1,61.82 18.73,81.19 PORTG.3
(TXD1/INT3)PD3  (via drill 0.2 pad 0.3)
  Top 0.3: U1.46 49.37,53.72 v49.37,55.16
  Bottom 0.3: PORTD.5 83.65,84.73 54.07,55.15 49.76,55.15 49.74,55.16 v49.37,55.16
(WR)PG0  (via drill 0.2 pad 0.3)
  Top 0.3: U1.51 52.43,49.09 52.43,48.34 50.91,46.82 v46.23,46.82 | v38,56.57 37.97,56.59 36.09,56.59 34.8,55.3 34.8,53.77 v39.34,49.23
  Bottom 0.3: v46.23,46.82 41.76,46.82 v39.35,49.23 v39.34,49.23 | v38,56.57 39.55,58.12 39.55,61.79 26.35,74.98 PORTG.6
(XCK0/AIN0)PE2  (via drill 0.2 pad 0.3)
  Top 0.3: v48.31,64.11 48.31,63.73 48.69,63.35 49.33,63.35 50.34,64.36 50.34,66.02 U1.4
  Bottom 0.3: PORTE.6 85.81,92.82 85.55,92.56 84.24,92.56 54.27,62.59 49.7,62.59 48.31,63.98 v48.31,64.11
(XCK1)PD5  (via drill 0.2 pad 0.3)
  Top 0.3: U1.48 50.69,53.62 v50.69,56.56
  Bottom 0.3: v50.69,56.56 54.02,56.56 87.27,89.81 PORTD.3
+3V3  (via drill 0.2 pad 0.3)
  Top 0.61: v16.13,34.65 15.8,34.98 v15.8,46.99 | v25.6,71.91 27.96,74.27 v27.96,74.32 | v52.78,81.38 v42.19,81.38
  Top 0.813: U4.4 U4.2 25.68,17.04 19.52,10.89 3.3V.1 3.3V.2 3.3V.3 19.53,4.56 19.53,2.13 19.52,2.12 3.3V.4
  Bottom 0.61: U4.4 24.11,27.55 C6.1 C13.1 18.85,31.93 v16.13,34.65 | ESP8266.C2 ESP8266.B2 | ESP8266.C2 ESP8266.D2 | ESP8266.C2 63.24,94 C14.1 63.26,87.08 C7.1 63.26,81.25 61.78,79.77 59.89,79.77 58.28,81.38 v52.78,81.38 | v15.8,46.99 15.8,62.1 v25.6,71.91 | v27.96,74.32 35.03,81.38 v42.19,81.38
  Bottom 0.813: R8.2 24.27,24.58 U4.4
  other vias: 25.68,25.98
+5V  (via drill 0.2 pad 0.3)
  Top 0.3: C3.1 59.37,49.22 U1.61 52.93,55.65 52.93,59.05 54.86,60.98 56.64,60.98 U1.80 60.86,65.2 60.86,68.2 58.37,70.69 v57.75,70.69 | U1.100 49.89,71.42 C4.1 46.15,71.98 43.79,69.62 43.79,68.33 U1.10 46.13,65.99 46.13,65.53 45.77,65.17 45.77,62.64 42.5,59.37 42.5,57.49 42.52,57.47 | v36.42,55.81 37.16,55.07 40.12,55.07 U1.31 42.52,57.47 | v33.35,56.55 31.37,58.52 R1.2 | v13.61,45.54 13.61,34.14 v14.81,32.94 | 42.52,57.6 42.52,57.47
  Top 0.61: U2.16 49.63,25.63 48.67,26.59 v43.33,26.59 | 34.56,21.67 33.75,21.67 | 33.7,21.67 28.52,21.67 27.96,21.11 U4.3 | 33.7,21.67 33.75,21.67 | 33.75,21.67 34.56,20.85 | 33.7,21.67 34.56,22.53
  Top 0.813: U4.3 27.96,16.41 22.86,11.3 5V.1 5V.2 5V.3 5V.4 | U3.4 34.56,22.53 34.56,21.67 34.56,20.85 U3.2 | R2.2 47.01,15.59 v44.7,13.28 | R4.1 60.96,20.9 v60.96,16.92 63.5,14.38 63.5,3.73 65.81,1.42 82.45,1.42 83.11,2.08 SPI.2
  Bottom 0.3: v36.42,55.81 34.08,55.81 v33.35,56.55 33.35,55.83 23.1,45.58 13.65,45.58 v13.61,45.54 | v14.81,32.94 14.81,25.96 20.4,20.37 26.82,20.37 26.85,20.4 26.86,20.4 U4.3 | C4.1 52.61,69.27 56.35,69.27 v57.75,70.69
  Bottom 0.61: v43.33,26.59 38.81,26.59 | 38.81,26.59 38.19,25.98 U3.4 | 38.81,26.59 38.81,27.43 38.3,27.94 C5.1 36.45,28 C12.1
  Bottom 0.813: R6.2 35.97,24.58 U3.4 | 56.94,15.14 58.12,13.97 58.12,13.13 52.76,7.77 43.23,7.77 | USB.1 56.94,15.14 | 56.94,15.14 59.47,15.14 60.96,16.64 v60.96,16.92 | v44.7,13.28 43.23,11.81 43.23,7.77 | 43.23,7.77 40.01,4.55 22.88,4.55 5V.3
  other vias: 34.57,25.98 31.37,59.44 27.97,19.29
AREF
  Top 0.3: C8.1 51.12,75.13 53.52,75.13 54.13,74.52 54.13,71.21 U1.98
D+
  Top 0.61: USB.3 51.98,13.14 51.18,13.95 51.18,16.03 52.32,17.17 53.31,17.17 54.71,18.56 U2.5
D-
  Top 0.61: USB.2 52.77,16.02 53.09,16.33 54.08,16.33 55.98,18.23 U2.6
DTR
  Top 0.61: U2.13 53.44,26.24 C11.1
GND  (via drill 0.2 pad 0.3)
  Top 0.3: U1.62 58.92,50.37 67.08,50.37 C3.2 | U1.99 52.43,70.2 52.43,71.98 C4.2 C8.2 | C13.2 26.64,31.88 C6.2 26.66,27.95 PWR-3V3.C PWR-5V.C C5.2 33.86,31.83 C12.2 33.95,32.56 34.9,33.5 40.36,33.5 | C10.1 42.68,31.18 40.36,33.5 | U1.32 40.22,54.46 37.33,54.46 37.32,54.46 36.29,54.46 v35.66,53.83 | v46.2,36.67 46.2,35.79 45.83,35.41 43.92,35.41 42.01,33.5 40.36,33.5 | U1.11 43.08,68.34 43.08,69.95 48.27,75.14 v49.25,75.14 | v48.79,34.53 48.79,36.12 49.38,36.7 64.54,36.7 65.56,35.69 65.56,32.03 64.75,31.22 C9.1 | U1.81 60.25,65.3 60.25,65.84 v60.2,65.89 | v66.45,72.11 62.64,75.92 v62.61,75.92
  Top 0.6: J2.2 39.03,13.63 C15.2
  Top 0.61: U2.1 49.63,15.87 48,14.25 USB.SH1 | RST.4 RST.3 | C1.1 35.97,45.53 C2.1
  Top 0.813: U4.1 23.39,17.44 16.19,10.25 GND.1 GND.2 GND.3 GND.4 | U3.1 31.17,19.29 30.12,18.24 30.12,9.17 31.53,7.76 J2.1 36.03,7.76 J2.2 47.68,10.76 USB.SH1 USB.SH2 57.33,13.14 USB.4 | SPI.4 SPI.6 SPI.8 SPI.10
  Bottom 0.3: C8.2 50.91,75.43 50.62,75.14 v49.25,75.14 | 51.89,82.35 C7.2 60.72,87.08 C14.2 | 50.9,75.44 50.9,81.36 51.89,82.35 | ESP8266.A1 51.89,90.27 51.89,82.35 | v35.66,53.83 34.27,53.83 31.27,50.83 31.27,50.23 C1.1 | v46.2,36.67 46.16,36.63 36.6,36.63 35.97,37.26 C2.1 | U2.1 50.65,20.65 50.65,24.18 48.79,26.04 v48.79,34.53 | v60.2,65.89 66.43,72.11 v66.45,72.11 | v62.61,75.92 58.12,71.42 52.99,71.42 C4.2
  Bottom 0.813: USB.SH2 60.04,5.72 61.11,4.65 72.92,4.65 SPI.10
  other vias: 49.61,92.61 49.61,91.11 49.61,89.61 49.61,88.11 49.61,86.61 49.61,85.11 49.61,83.61 39.61,89.43 39.61,87.93 39.61,86.43 38.61,89.43 38.61,87.93 38.61,86.43 37.61,89.43 37.61,87.93 37.61,86.43 36.61,89.43 36.61,87.93 36.61,86.43 35.61,89.43 35.61,87.93 35.61,86.43 34.61,89.43 34.61,87.93 34.61,86.43 33.61,89.43 33.61,87.93 33.61,86.43 28.61,86.43 28.61,84.93 28.61,83.43 27.54,87.29 27.54,85.79 27.54,84.29 29.57,85.49 29.57,83.99 29.57,82.49 30.57,84.67 30.57,83.17 30.57,81.67 31.61,83.78 31.61,82.28 31.61,80.78 32.57,82.72 32.57,81.22 34.25,79.29 34.25,77.79 35.01,79.97 35.01,78.47 35.01,76.97 35.8,79.34 35.8,77.84 35.8,76.34 78.35,66.41 79.85,66.41 81.35,66.41 82.85,66.41 84.35,66.41 85.85,66.41 87.35,66.41 78.35,65.41 79.85,65.41 81.35,65.41 82.85,65.41 84.35,65.41 85.85,65.41 87.35,65.41 78.35,64.41 79.85,64.41 81.35,64.41 82.85,64.41 84.35,64.41 85.85,64.41 87.35,64.41 78.35,63.41 79.85,63.41 81.35,63.41 82.85,63.41 84.35,63.41 85.85,63.41 87.35,63.41 78.35,62.41 79.85,62.41 81.35,62.41 82.85,62.41 84.35,62.41 85.85,62.41 87.35,62.41 78.35,61.41 79.85,61.41 81.35,61.41 82.85,61.41 84.35,61.41 85.85,61.41 87.35,61.41 78.35,60.41 79.85,60.41 81.35,60.41 82.85,60.41 84.35,60.41 85.85,60.41 87.35,60.41 78.35,59.41 79.85,59.41 81.35,59.41 82.85,59.41 84.35,59.41 85.85,59.41 87.35,59.41 78.35,58.41 79.85,58.41 81.35,58.41 82.85,58.41 84.35,58.41 85.85,58.41 87.35,58.41 78.35,57.41 79.85,57.41 81.35,57.41 82.85,57.41 84.35,57.41 85.85,57.41 87.35,57.41 18.47,50.25 19.54,51.31 18.47,48.88 19.54,49.95 18.47,51.6 19.54,52.66 18.47,52.87 19.54,53.93 18.47,54.24 19.54,55.3 18.47,47.49 19.54,48.55 19.54,46.97 17.26,49.86 17.26,48.5 17.26,51.21 17.26,52.49 17.26,53.85 17.26,47.1 12.96,49.98 12.96,48.48 12.96,46.98 11.96,49.98 11.96,48.48 11.96,46.98 10.96,49.98 10.96,48.48 10.96,46.98 9.96,49.98 9.96,48.48 9.96,46.98 8.96,49.98 8.96,48.48 8.96,46.98 7.96,49.98 7.96,48.48 7.96,46.98 49.63,19.63
  pour Bottom (isolate 0.3): -2.39,101.83 102.03,101.83 102.03,-3.45 -2.39,-3.45
  pour Top (isolate 0.3): -5.31,103.33 103.63,103.33 103.63,-4.27 -5.31,-4.27
MCLR  (via drill 0.2 pad 0.3)
  Top 0.3: SPI.5 78.03,22.15 73.69,26.49 v68.68,26.49 | v65.84,26.52 58.38,26.52 RSTJ.2 | U1.30 40.15,55.81 v37.36,55.81 | v17.73,46.23 17.73,36.07 v17.68,36.02
  Bottom 0.3: v68.68,26.49 65.86,26.49 v65.84,26.52 | v37.36,55.81 34.28,58.89 RST.1 | RST.2 28.31,53.18 26.91,53.18 19.96,46.23 v17.73,46.23 | v17.68,36.02 51.66,36.02 55.45,32.23 RSTJ.2
  Bottom 0.61: R1.1 28.52,56.59 28.52,55.71 RST.2 RST.1
MISO  (via drill 0.2 pad 0.3)
  Top 0.3: U1.22 37.72,65.91 30.24,65.91 22.58,58.26 22.58,47.55 28.86,41.27 v40.26,41.27 | PORTB.5 87.25,34.73 80.72,41.27 v45.64,41.27 | v85.98,27.79 81.61,23.42 v81.58,23.42
  Bottom 0.3: SPI.9 72.95,14.78 v81.58,23.42 | v85.98,27.79 86.03,27.79 92.97,34.73 PORTB.5 | v40.26,41.27 v45.64,41.27
MOSI  (via drill 0.2 pad 0.3)
  Top 0.3: U1.21 37.91,66.44 30.06,66.44 22.08,58.46 22.08,47.07 28.54,40.61 v39.65,40.61 | PORTB.6 89.06,32.19 80.63,40.61 v46.35,40.61 | SPI.1 83.07,7.47 81.64,8.9 81.64,21.75 v86.79,26.9
  Bottom 0.3: PORTB.6 92.08,32.19 v86.79,26.9 | v46.35,40.61 v39.65,40.61
N$1  (via drill 0.2 pad 0.3)
  Top 0.61: R2.1 46.97,23.77 v46.97,25.4
  Bottom 0.61: v46.97,25.4 47.02,25.45 47.02,31.69 RX.A
  other vias: 47.06,31.73
N$2  (via drill 0.2 pad 0.3)
  Top 0.61: R4.2 v60.94,25.5
  Bottom 0.61: v60.94,25.5 60.98,25.55 TX.A
  other vias: 60.99,31.73
N$3  (via drill 0.2 pad 0.3)
  Bottom 0.61: PWR-5V.A 31.52,22.73 31.77,22.48 R6.1
  other vias: 31.52,25.85
N$6  (via drill 0.2 pad 0.3)
  Bottom 0.61: R8.1 28.4,22.48 28.7,22.78 PWR-3V3.A
  other vias: 28.7,25.85
N$100
  Top 0.61: C11.2 52.91,29.31 RSTJ.1
PH0(RXD2)
  Top 0.3: U1.12 19.45,91.26 12.09,91.26 8.46,94.89 PORTH.8
PH1(TXD2)
  Top 0.3: U1.13 19.36,90.64 11.93,90.64 10.21,92.35 PORTH.7
PH2(XCK2)
  Top 0.3: U1.14 19.48,89.81 PORTH.6
PH3(OC4A)
  Top 0.3: PORTH.5 21.32,87.27 U1.15
PH4(OC4B)
  Top 0.3: PORTH.4 23.15,84.73 U1.16
PH5(OC4C)
  Top 0.3: PORTH.3 24.98,82.19 U1.17
PH6(OC2B)
  Top 0.3: PORTH.2 26.81,79.65 U1.18
PH7(T4)  (via drill 0.2 pad 0.3)
  Top 0.3: PORTH.1 28.43,77.11 v37.05,68.49 | v43.84,61.65 43.84,61.62 41.55,59.33 U1.27
  Bottom 0.3: v37.05,68.49 43.84,61.7 v43.84,61.65
PJ0(RXD3/PCINT9)  (via drill 0.2 pad 0.3)
  Top 0.3: U1.63 59.1,50.9 66.01,50.9 68.11,53 68.11,68.97 v57.75,79.32 | v52.2,80.37 41.05,80.37 36.76,76.08 v36.74,76.08 | v32.23,71.91 28.45,71.91 26.43,69.89 PORTJ.8
  Bottom 0.3: v57.75,79.32 56.7,80.37 v52.2,80.37 | v36.74,76.08 32.81,72.15 32.8,72.15 32.56,71.91 v32.23,71.91
PJ1(TXD3/PCINT10)  (via drill 0.2 pad 0.3)
  Top 0.3: U1.64 59.31,51.4 65.8,51.4 67.61,53.21 67.61,68.45 v57.75,78.31 | v52.95,79.72 41.3,79.72 v36.72,75.14 | v33.07,71.5 32.83,71.26 28.51,71.26 24.6,67.35 PORTJ.7
  Bottom 0.3: v57.75,78.31 56.34,79.72 v52.95,79.72 | v36.72,75.14 33.08,71.5 v33.07,71.5
PJ2(XCK3/PCINT11)  (via drill 0.2 pad 0.3)
  Top 0.3: U1.65 | U1.65 59.51,51.9 65.59,51.9 67.11,53.41 67.11,67.94 v57.75,77.3 | v52.2,79.07 41.57,79.07 v37.65,75.15 | v32.94,70.61 32.92,70.63 28.59,70.63 22.76,64.81 PORTJ.6
  Bottom 0.3: v57.75,77.3 55.98,79.07 v52.2,79.07 | v37.65,75.15 33.12,70.61 v32.94,70.61
PJ3(PCINT12)  (via drill 0.2 pad 0.3)
  Top 0.3: U1.66 59.72,52.4 65.39,52.4 66.61,53.62 66.61,67.43 v57.75,76.29 | v52.95,78.41 41.84,78.41 v37.65,74.22 | v33.99,70.56 33.86,70.56 33.26,69.95 28.62,69.95 20.93,62.27 PORTJ.5
  Bottom 0.3: v57.75,76.29 57.74,76.29 55.64,78.39 52.98,78.39 v52.95,78.41 | v37.65,74.22 v33.99,70.56
PJ4(PCINT13)  (via drill 0.2 pad 0.3)
  Top 0.3: U1.67 59.93,52.9 65.18,52.9 66.11,53.83 66.11,66.92 v57.75,75.28 | v52.2,77.76 42.12,77.76 v38.6,74.25 | v33.96,69.61 33.81,69.45 28.82,69.45 19.1,59.73 PORTJ.4
  Bottom 0.3: v57.75,75.28 55.26,77.76 v52.2,77.76 | v38.6,74.25 v33.96,69.61
PJ5(PCINT14)  (via drill 0.2 pad 0.3)
  Top 0.3: U1.68 60.13,53.4 64.97,53.4 65.61,54.04 65.61,66.4 v57.75,74.26 | v52.95,77.11 42.38,77.11 v38.56,73.28 | v34.9,69.62 34.23,68.95 29.03,68.95 17.27,57.19 PORTJ.3
  Bottom 0.3: v57.75,74.26 54.9,77.11 v52.95,77.11 | v38.56,73.28 v34.9,69.62
PJ6(PCINT15)  (via drill 0.2 pad 0.3)
  Top 0.3: U1.69 60.34,53.9 64.62,53.9 65.1,54.38 65.1,62.23 65.08,62.26 65.08,65.94 57.76,73.25 v57.75,73.25 | v34.95,68.68 34.72,68.45 29.23,68.45 15.43,54.65 PORTJ.2 | v39.65,73.36 42.75,76.45 v52.2,76.45
  Bottom 0.3: v57.75,73.25 54.55,76.45 v52.2,76.45 | v39.65,73.36 39.62,73.36 v34.95,68.68
PJ7  (via drill 0.2 pad 0.3)
  Top 0.3: PORTJ.1 13.61,52.11 29.43,67.94 35.32,67.94 v35.97,68.58 | v39.6,72.24 43.16,75.79 v52.95,75.79 | v57.75,72.24 61.47,68.52 61.47,65.1 U1.79
  Bottom 0.3: v35.97,68.58 39.6,72.21 v39.6,72.24 | v52.95,75.79 54.19,75.79 v57.75,72.24
PK0(ADC8/PCINT16)  (via drill 0.2 pad 0.3)
  Top 0.3: U1.89 54.51,65.22 53.33,65.22 47.7,59.59 43.91,59.59 v43.75,59.43
  Bottom 0.3: v43.75,59.43 43.04,58.72 42.15,58.72 38.42,54.99 33.9,54.99 23.81,44.89 PORTK.8
PK1(ADC9/PCINT17)  (via drill 0.2 pad 0.3)
  Top 0.3: U1.88 54.72,64.72 53.54,64.72 47.8,58.98 44.53,58.98 v44.37,58.82
  Bottom 0.3: v44.37,58.82 43.73,58.18 42.38,58.18 38.69,54.48 34.14,54.48 24.04,44.39 20.02,44.39 17.98,42.35 PORTK.7
PK2(ADC10/PCINT18)  (via drill 0.2 pad 0.3)
  Top 0.3: U1.87 54.93,64.22 53.74,64.22 47.87,58.34 45.12,58.34 v44.98,58.2
  Bottom 0.3: v44.98,58.2 44.38,57.6 42.77,57.6 29.06,43.89 20.23,43.89 16.15,39.81 PORTK.6
PK3(ADC11/PCINT19)  (via drill 0.2 pad 0.3)
  Top 0.3: U1.86 55.14,63.72 53.95,63.72 48.02,57.78 45.8,57.78 v45.6,57.59
  Bottom 0.3: v45.6,57.59 44.94,56.92 42.8,56.92 29.27,43.39 20.47,43.39 14.35,37.27 PORTK.5
PK4(ADC12/PCINT20)  (via drill 0.2 pad 0.3)
  Top 0.3: U1.85 55.34,63.22 54.18,63.22 48.16,57.2 46.44,57.2 v46.21,56.97
  Bottom 0.3: v46.21,56.97 45.58,56.34 42.93,56.34 29.49,42.89 20.68,42.89 12.52,34.73 PORTK.4
PK5(ADC13/PCINT21)  (via drill 0.2 pad 0.3)
  Top 0.3: U1.84 55.55,62.72 54.41,62.72 48.33,56.64 47.11,56.64 v46.83,56.35
  Bottom 0.3: v46.83,56.35 46.23,55.76 43.06,55.76 29.7,42.39 20.89,42.39 10.69,32.19 PORTK.3
PK6(ADC14/PCINT22)  (via drill 0.2 pad 0.3)
  Top 0.3: U1.83 55.76,62.22 54.61,62.22 48.46,56.06 47.77,56.06 v47.44,55.74
  Bottom 0.3: v47.44,55.74 46.84,55.14 43.18,55.14 29.93,41.89 21.1,41.89 8.86,29.65 PORTK.2
PK7(ADC15/PCINT23)  (via drill 0.2 pad 0.3)
  Top 0.3: U1.82 55.96,61.72 54.85,61.72 48.25,55.12 v48.06,55.12
  Bottom 0.3: v48.06,55.12 47.56,54.63 43.38,54.63 30.14,41.39 21.31,41.39 7.03,27.11 PORTK.1
PL0(ICP4)
  Top 0.3: U1.35 41.38,53.5 41.38,39.04 40.97,38.63 21.77,38.63 9.07,25.93 9.07,21.8 7.17,19.89 PORTL.8
PL1(ICP5)
  Top 0.3: U1.36 41.88,53.3 41.88,38.84 41.17,38.13 21.97,38.13 9.57,25.73 9.57,19.4 7.52,17.35 PORTL.7
PL2(T5)
  Top 0.3: U1.37 42.38,53.09 42.38,38.63 41.38,37.63 22.18,37.63 10.07,25.52 10.07,17.44 7.44,14.81 PORTL.6
PL3(OC5A)
  Top 0.3: U1.38 42.88,52.88 42.88,38.42 41.59,37.13 22.39,37.13 10.57,25.31 10.57,14.79 8.05,12.27 PORTL.5
PL4(OC5B)
  Top 0.3: U1.39 43.38,52.67 43.38,38.21 41.8,36.63 22.59,36.63 11.07,25.11 11.07,13.05 7.75,9.73 PORTL.4
PL5(OC5C)
  Top 0.3: U1.40 43.88,52.47 43.88,38.01 41.95,36.08 22.75,36.08 11.57,24.9 11.57,10.33 8.44,7.19 PORTL.3
PL6
  Top 0.3: U1.41 44.38,52.26 44.38,37.75 42.21,35.58 22.96,35.58 12.07,24.69 12.07,8.08 8.65,4.65 PORTL.2
PL7
  Top 0.3: U1.42 44.88,52.05 44.88,37.52 42.44,35.08 23.16,35.08 12.57,24.49 12.57,4.6 10.09,2.11 PORTL.1
RX  (via drill 0.2 pad 0.3)
  Top 0.61: v58.83,23.72 52.71,23.72 52.17,23.18 U2.3
  Bottom 0.61: R3.2 v58.83,23.72
RX0
  Top 0.61: TXJ.1 41.46,21.05 41.07,21.44 41.07,27.3 43.39,29.63 RX.C
  Bottom 0.61: TXJ.1 46.88,21.05 R5.2
RX1
  Bottom 0.61: RXE.1 67.26,95.12 ESP8266.D1
RXC  (via drill 0.2 pad 0.3)
  Top 0.3: v46.58,64.16 46.58,63.93 48.18,62.33 49.73,62.33 51.44,64.03 51.44,66.34 U1.2
  Top 0.61: TXE.2 57.99,84.85 57.99,81.86 59.36,80.49 70.64,80.49 74.68,76.45 v74.68,50.52 74.68,49.55 arc90 75.46,48.77 75.82,48.77 arc90 76.6,49.55 76.6,78.73 90.89,93.02 PORTE.8 | v74.83,38.53 71.3,35 v71.3,34.87
  Bottom 0.3: PORTE.8 87.45,91.56 84.65,91.56 54.38,61.29 49.33,61.29 46.58,64.03 v46.58,64.16
  Bottom 0.61: v74.68,50.52 74.68,38.68 v74.83,38.53 | TXJ.2 41.48,23.59 40.89,23.01 40.89,18.92 41.78,18.03 67.54,18.03 73.86,24.36 73.86,32.31 v71.3,34.87
SCK  (via drill 0.2 pad 0.3)
  Top 0.3: U1.20 38.11,66.94 29.85,66.94 21.58,58.67 21.58,46.87 28.49,39.96 v40.27,39.96 | PORTB.7 90.86,29.65 80.55,39.96 v45.74,39.96 | v83.34,21.74 87.58,25.98 v87.61,25.98
  Bottom 0.3: SPI.7 75.49,13.89 v83.34,21.74 | v87.61,25.98 91.27,29.65 PORTB.7 | v40.27,39.96 v45.74,39.96
TX  (via drill 0.2 pad 0.3)
  Top 0.61: v48.85,23.72 49.84,23.72 50.9,22.66 U2.2
  Bottom 0.61: R5.1 v48.85,23.72
TX0
  Top 0.61: RXJ.1 66.77,21.05 67.11,21.39 67.11,27.61 65.09,29.63 TX.C
  Bottom 0.61: RXJ.1 64.32,20.92 R3.1
TX1
  Bottom 0.61: TXE.1 57,92.84 ESP8266.A2
TXC  (via drill 0.2 pad 0.3)
  Top 0.3: v75.69,50.52 75.72,50.55 | v47.43,64.12 47.43,63.8 48.39,62.84 49.53,62.84 50.9,64.21 50.9,66.17 U1.3
  Top 0.61: RXE.2 72.95,85.83 75.72,83.06 75.72,81.05 | 75.72,50.55 75.72,81.05 | v75.71,37.79 75.71,37.56 v70.28,32.13 | 75.72,81.05 88.35,93.68 PORTE.7
  Bottom 0.3: PORTE.7 88.35,93.68 86.72,92.06 84.45,92.06 54.33,61.94 49.54,61.94 47.43,64.05 v47.43,64.12
  Bottom 0.61: v75.69,50.52 75.69,37.8 v75.71,37.79 | v70.28,32.13 64.45,26.3 RXJ.2
V3  (via drill 0.35)
  Top 0.6: U2.4 53.44,18.79 52.76,18.11 51.44,18.11 50.62,17.3 v50.62,17.09
  Bottom 0.6: v50.62,17.09 45.03,17.09 C15.1
VIN
  Top 0.813: U3.3 36.85,17.3 34.23,14.67 J2.3
XI  (via drill 0.2 pad 0.3)
  Top 0.61: v57,20.95 57.25,20.71 U2.7 | C10.2 | C10.2 Y2.2
  Bottom 0.61: v57,20.95 56.05,20.95 50.62,26.39 50.62,32.66 Y2.2
XO  (via drill 0.2 pad 0.3)
  Top 0.61: v58.52,21.36 U2.8 | Y2.1 56.55,33.76 C9.2
  Bottom 0.61: Y2.1 57.94,32.3 57.94,21.95 v58.52,21.36
XTAL1
  Top 0.3: U1.34 40.32,53.15 Y1.2 40.32,48.27 39.09,47.09 C2.2
XTAL2
  Top 0.3: U1.33 39.92,53.45 Y1.1
  Bottom 0.3: Y1.1 36.41,53.45 C1.2